# EAGLE schematic transmitter_pcb (EAGLE 6.1)
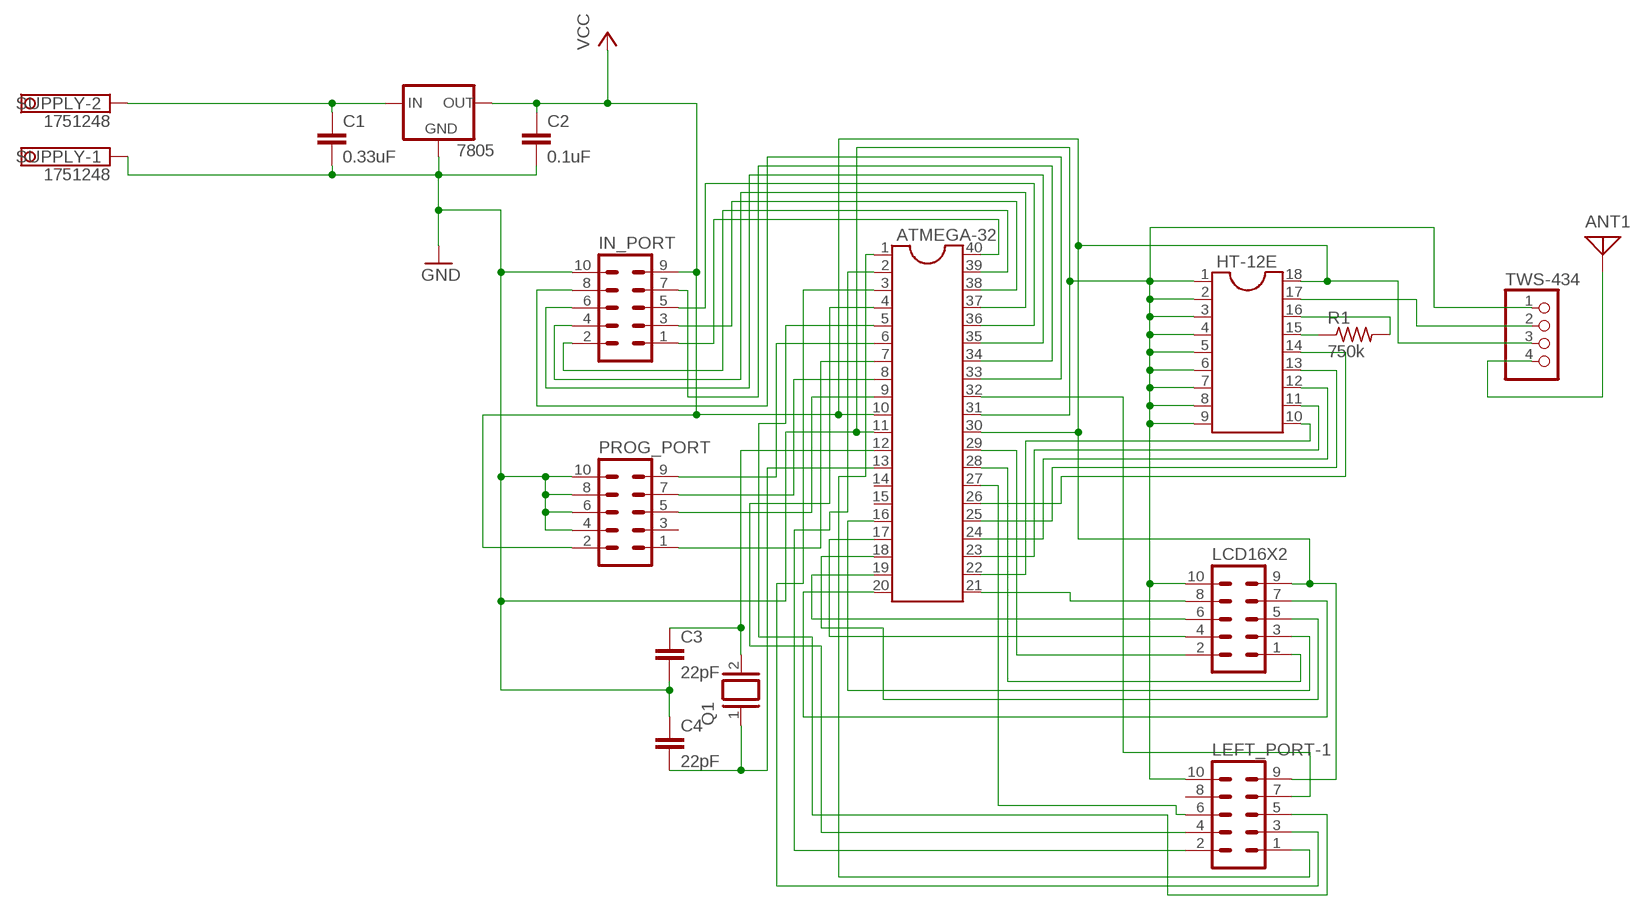
[diagram p0: schematic, sheet 1]

## Parts
7805  78XXS  [78XXS]
ANT1  ANTENNA  [PAD-01]
ATMEGA-32  DIL40  [DIL40]
C1  0.33uF  C2.5/2  [C2.5-2]
C2  0.1uF  C2.5/2  [C2.5-2]
C3  22pF  C2.5/2  [C2.5-2]
C4  22pF  C2.5/2  [C2.5-2]
HT-12E  DIL18  [DIL18]
IN_PORT  ML10  [ML10]
LCD16X2  ML10  [ML10]
LEFT_PORT-1  ML10  [ML10]
PROG_PORT  ML10  [ML10]
Q1  XTAL/S  [QS]
R1  750k  R-US_0204/5  [0204/5]
SUPPLY  1751248  [1751248]
TWS-434  PINHD-1X4  [1X04]

## Nets
GND: 7805.GND ATMEGA-32.11 ATMEGA-32.31 C1.2 C2.2 C3.2 C4.1 HT-12E.1 HT-12E.2 HT-12E.3 HT-12E.4 HT-12E.5 HT-12E.6 HT-12E.7 HT-12E.8 HT-12E.9 IN_PORT.10 LCD16X2.10 LEFT_PORT-1.10 PROG_PORT.4 PROG_PORT.6 PROG_PORT.8 PROG_PORT.10 SUPPLY.1 TWS-434.1
N$1: ATMEGA-32.27 LEFT_PORT-1.6
N$2: ATMEGA-32.29 LCD16X2.2
N$3: 7805.IN C1.1 SUPPLY.2
N$4: ATMEGA-32.40 IN_PORT.1
N$5: ATMEGA-32.28 LCD16X2.1
N$6: ATMEGA-32.39 IN_PORT.2
N$7: ATMEGA-32.6 PROG_PORT.9
N$8: HT-12E.15 R1.1
N$9: HT-12E.16 R1.2
N$10: ATMEGA-32.12 C3.1 Q1.2
N$11: ATMEGA-32.13 C4.2 Q1.1
N$12: ATMEGA-32.38 IN_PORT.3
N$13: ATMEGA-32.37 IN_PORT.4
N$14: ATMEGA-32.36 IN_PORT.5
N$15: ATMEGA-32.35 IN_PORT.6
N$16: ATMEGA-32.34 IN_PORT.7
N$17: ATMEGA-32.33 IN_PORT.8
N$18: ATMEGA-32.8 PROG_PORT.7
N$19: ATMEGA-32.9 PROG_PORT.5
N$20: ATMEGA-32.7 PROG_PORT.1
N$21: ATMEGA-32.22 HT-12E.10
N$22: ATMEGA-32.23 HT-12E.11
N$23: ATMEGA-32.24 HT-12E.12
N$24: ATMEGA-32.25 HT-12E.13
N$25: ATMEGA-32.26 HT-12E.14
N$26: HT-12E.17 TWS-434.2
N$27: ATMEGA-32.32 LEFT_PORT-1.7
N$30: ANT1.1 TWS-434.4
N$34: ATMEGA-32.16 LCD16X2.3
N$35: ATMEGA-32.17 LCD16X2.4
N$36: ATMEGA-32.18 LCD16X2.5
N$37: ATMEGA-32.19 LCD16X2.6
N$38: ATMEGA-32.20 LCD16X2.7
N$39: ATMEGA-32.21 LCD16X2.8
N$41: ATMEGA-32.1 LEFT_PORT-1.1
N$42: ATMEGA-32.2 LEFT_PORT-1.2
N$43: ATMEGA-32.3 LEFT_PORT-1.3
N$44: ATMEGA-32.4 LEFT_PORT-1.4
N$45: ATMEGA-32.5 LEFT_PORT-1.5
VCC: 7805.OUT ATMEGA-32.10 ATMEGA-32.30 C2.1 HT-12E.18 IN_PORT.9 LCD16X2.9 LEFT_PORT-1.9 PROG_PORT.2 TWS-434.3
Unconnected: ATMEGA-32.14 ATMEGA-32.15 LEFT_PORT-1.8 PROG_PORT.3

## Library data of the parts
7805 = v-reg:78XXS: VOLTAGE REGULATOR
ANT1 = discrete:ANTENNA: Antenna
ATMEGA-32 = ic-package:DIL40: Dual In Line
C1-C4 = capacitor-wima:C: CAPACITOR naming: grid - package width
HT-12E = ic-package:DIL18: Dual In Line / Socket
IN_PORT LCD16X2 LEFT_PORT-1 PROG_PORT = con-harting-ml:ML10: HARTING; OC_FARNELL: unknown; OC_NEWARK: unknown
Q1 = special:XTAL/S: CRYSTAL
R1 = resistor:R-US_: RESISTOR, American symbol
SUPPLY = con-phoenix-350:1751248: MKDS 1/ 2-3,5 Printklemme Nennstrom: 10 A Bemessungsspannung: 160 V Raster: 3,5 mm Polzahl: 2 Montageart: Löten Anschlussart: Schraubanschluss Anschlussrichtung vom Leiter zur Platine: 0° Source: http://eshop.phoenixcontact.com .. 1751248.pdf; OC_FARNELL: unknown; OC_NEWARK: unknown
TWS-434 = pinhead:PINHD-1X4: PIN HEADER